# EAGLE schematic 9250 (EAGLE 9.2.2)
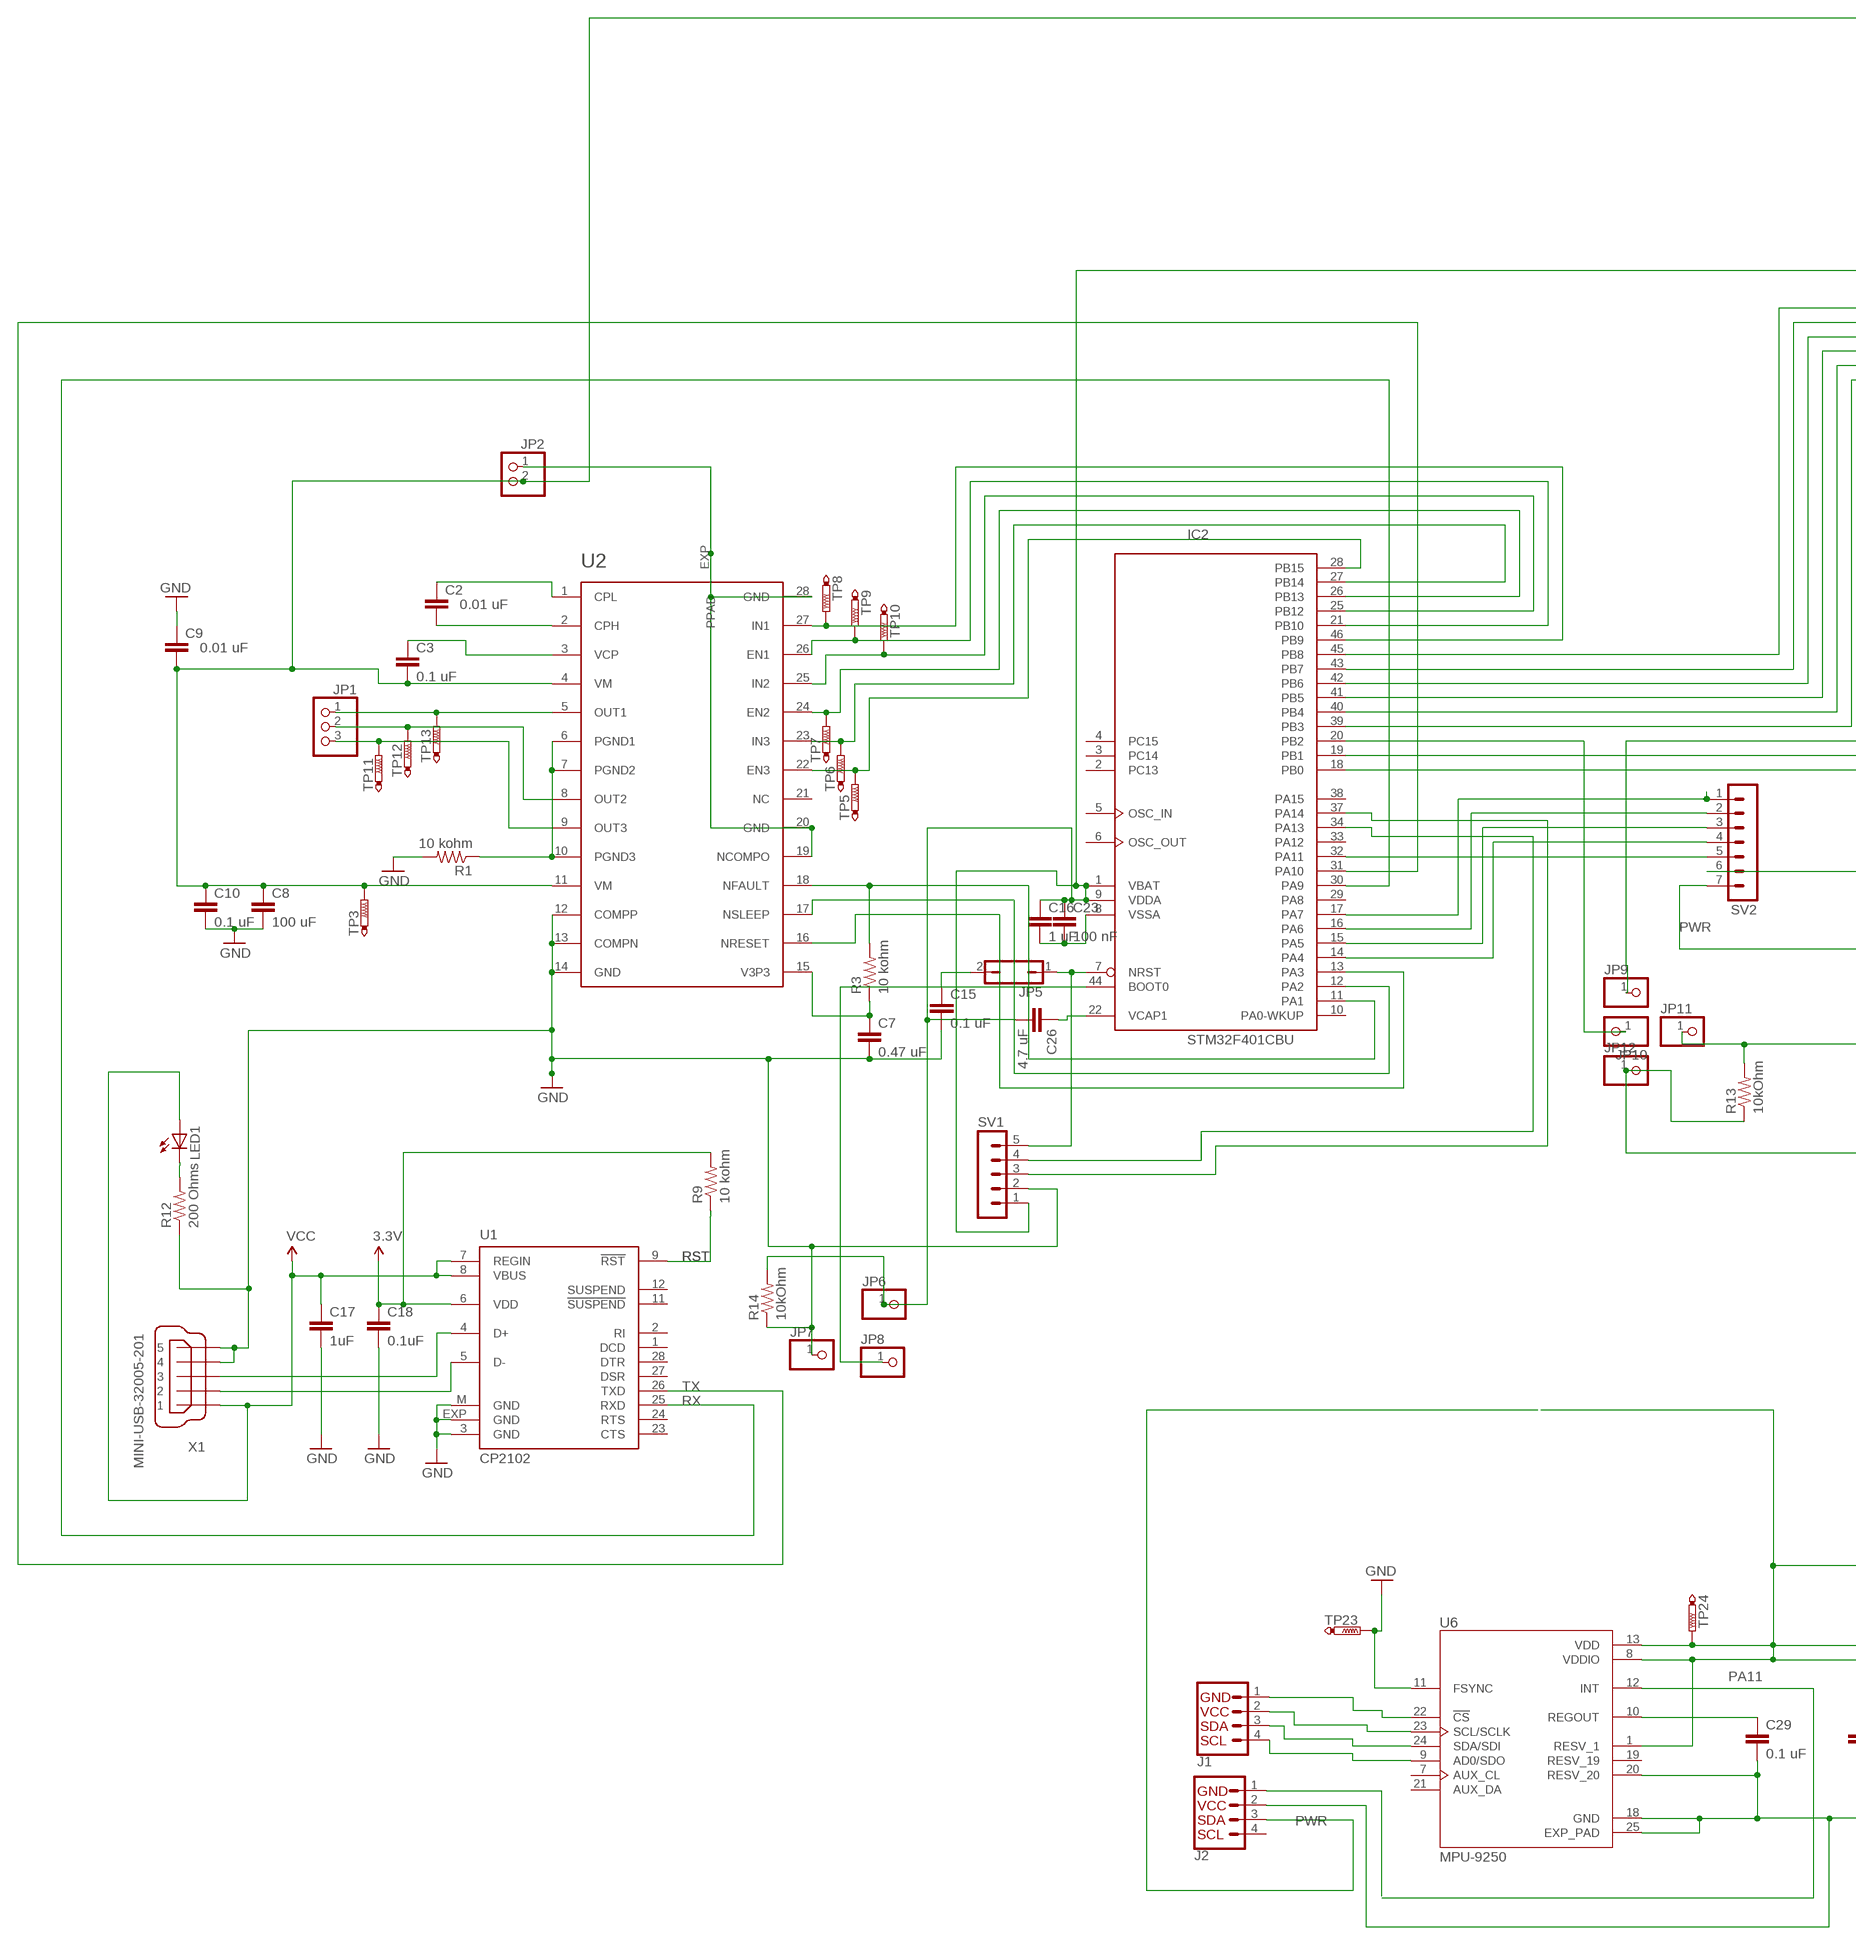
[diagram p0: schematic, sheet 1, part 1 of 2]
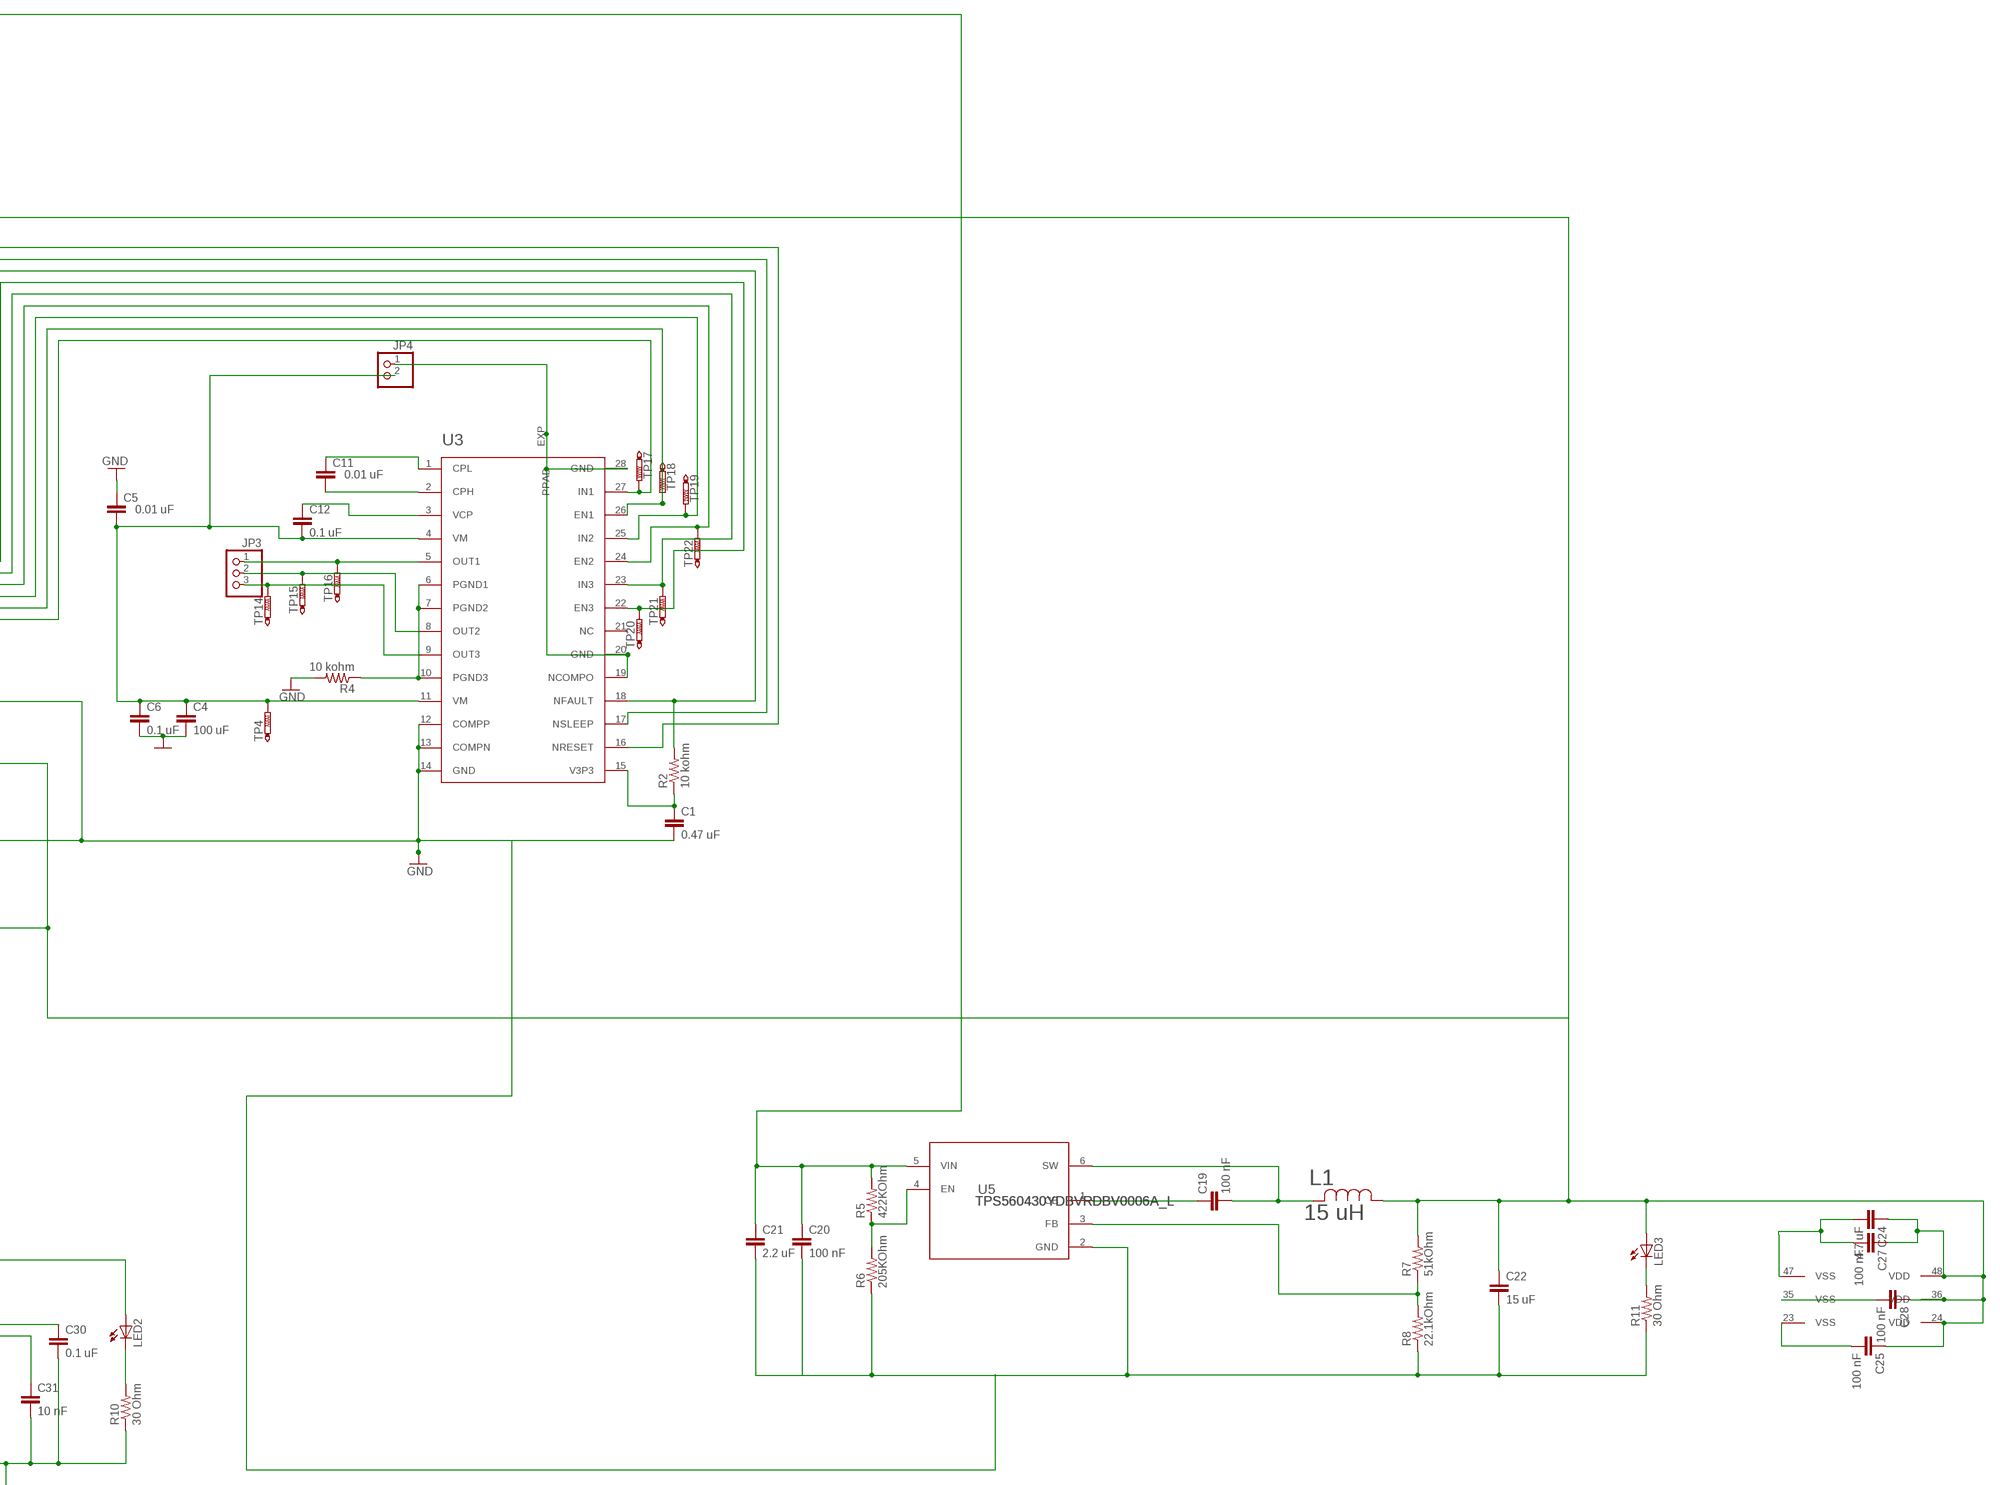
[diagram p1: schematic, sheet 1, part 2 of 2]

## Parts
C1  0.47 uF  C-EUC1210K  [C1210K]
C2  0.01 uF  C-EUC1210K  [C1210K]
C3  0.1 uF  C-EUC1210K  [C1210K]
C4  100 uF  C-EUC1210K  [C1210K]
C5  0.01 uF  C-EUC1210K  [C1210K]
C6  0.1 uF  C-EUC1210K  [C1210K]
C7  0.47 uF  C-EUC1210K  [C1210K]
C8  100 uF  C-EUC1210K  [C1210K]
C9  0.01 uF  C-EUC1210K  [C1210K]
C10  0.1 uF  C-EUC1210K  [C1210K]
C11  0.01 uF  C-EUC1210K  [C1210K]
C12  0.1 uF  C-EUC1210K  [C1210K]
C15  0.1 uF  C-EUC1210K  [C1210K]
C16  1 uF  C-EUC1210K  [C1210K]
C17  1uF  CAP0603  [0603]
C18  0.1uF  CAP0603  [0603]
C19  100 nF  C-EUC0402K  [C0402K]
C20  100 nF  C-EUC0402K  [C0402K]
C21  2.2 uF  C-EUC0402K  [C0402K]
C22  15 uF  C-EUC0402K  [C0402K]
C23  100 nF  C-EUC1210K  [C1210K]
C24  4.7 uF  C-EUC1210K  [C1210K]
C25  100 nF  C-EUC1210K  [C1210K]
C26  4.7 uF  C-EUC1210K  [C1210K]
C27  100 nF  C-EUC1210K  [C1210K]
C28  100 nF  C-EUC1210K  [C1210K]
C29  0.1 uF  C-EU025-025X050  [C025-025X050]
C30  0.1 uF  C-EU025-025X050  [C025-025X050]
C31  10 nF  C-EU025-025X050  [C025-025X050]
IC2  STM32F401CBU  [UFQFPN48]
J1  QWIIC_CONNECTORJS-1MM  [1X04_1MM_RA]
J2  QWIIC_CONNECTORJS-1MM  [1X04_1MM_RA]
JP1  PINHD-1X3/90  [1X03/90]
JP2  PINHD-1X2/90  [1X02/90]
JP3  PINHD-1X3/90  [1X03/90]
JP4  PINHD-1X2/90  [1X02/90]
JP5  JP1Q  [JP1]
JP6  PINHD-1X1  [1X01]
JP7  PINHD-1X1  [1X01]
JP8  PINHD-1X1  [1X01]
JP9  PINHD-1X1  [1X01]
JP10  PINHD-1X1  [1X01]
JP11  PINHD-1X1  [1X01]
JP12  PINHD-1X1  [1X01]
L1  15 uH  SRN3015-150M  [IND_BOURNS_SRN3015]
LED1  LED_ESML0603  [LED_SML0603]
LED2  LED_ESML0603  [LED_SML0603]
LED3  LED_ESML0603  [LED_SML0603]
R1  10 kohm  R-US_M2012  [M2012]
R2  10 kohm  R-US_M2012  [M2012]
R3  10 kohm  R-US_M2012  [M2012]
R4  10 kohm  R-US_M2012  [M2012]
R5  422KOhm  R-US_M0805  [M0805]
R6  205KOhm  R-US_M0805  [M0805]
R7  51kOhm  R-US_M0805  [M0805]
R8  22.1kOhm  R-US_M0805  [M0805]
R9  10 kohm  R-US_M2012  [M2012]
R10  30 Ohm  R-US_M0805  [M0805]
R11  30 Ohm  R-US_M0805  [M0805]
R12  200 Ohms  R-US_M0805  [M0805]
R13  10kOhm  R-US_M0805  [M0805]
R14  10kOhm  R-US_M0805  [M0805]
SV1  MA05-1  [MA05-1]
SV2  MA07-1  [MA07-1]
TP3  PTR1TP12R  [TP12R]
TP4  PTR1TP12R  [TP12R]
TP5  PTR1TP12R  [TP12R]
TP6  PTR1TP12R  [TP12R]
TP7  PTR1TP12R  [TP12R]
TP8  PTR1TP12R  [TP12R]
TP9  PTR1TP12R  [TP12R]
TP10  PTR1TP12R  [TP12R]
TP11  PTR1TP12R  [TP12R]
TP12  PTR1TP12R  [TP12R]
TP13  PTR1TP12R  [TP12R]
TP14  PTR1TP12R  [TP12R]
TP15  PTR1TP12R  [TP12R]
TP16  PTR1TP12R  [TP12R]
TP17  PTR1TP12R  [TP12R]
TP18  PTR1TP12R  [TP12R]
TP19  PTR1TP12R  [TP12R]
TP20  PTR1TP12R  [TP12R]
TP21  PTR1TP12R  [TP12R]
TP22  PTR1TP12R  [TP12R]
TP23  PTR1TP12R  [TP12R]
TP24  PTR1TP12R  [TP12R]
U1  CP2102  CP210X_USB_UART  [MLP28]
U2  DRV8313PWPR  [HTSSOP28PWP]
U3  DRV8313PWPR  [HTSSOP28PWP]
U5  TPS560430YDBVRDBV0006A_L  [DBV0006A_L]
U6  MPU-9250  [QFN40P300X300X105-25N]
X1  MINI-USB-32005-201  [32005-201]

## Nets
3.3V: C18.1 R9.2 U1.6(VDD)
BATTERY: C3.2 C8.1 C9.2 C10.1 C20.1 C21.1 JP2.2 R5.2 TP3.TP U2.4(VM) U2.11(VM) U5.5(VIN)
BATTERY1: C4.1 C5.2 C6.1 C12.2 JP4.2 TP4.TP U3.4(VM) U3.11(VM)
CPH: C2.2 U2.2(CPH)
CPH1: C11.2 U3.2(CPH)
CPL: C2.1 U2.1(CPL)
CPL1: C11.1 U3.1(CPL)
EN4: IC2.19(PB1) TP18.TP U3.26(EN1)
EN5: IC2.39(PB3) TP22.TP U3.24(EN2)
EN6: IC2.41(PB5) TP20.TP U3.22(EN3)
GND: C1.2 C4.2 C5.1 C6.2 C7.2 C8.2 C9.1 C10.2 C15.2 C17.2 C18.2 JP2.1 JP4.1 JP7.1 JP11.1 R1.2 R4.2 R12.1 R13.2 R14.1 SV1.2 SV2.6 TP23.TP U1.3(GND) U1.EXP(GND) U1.M(GND) U2.12(COMPP) U2.13(COMPN) U2.14(GND) U2.19(NCOMPO) U2.20(GND) U2.28(GND) U2.EXP(PPAD) U3.12(COMPP) U3.13(COMPN) U3.14(GND) U3.19(NCOMPO) U3.20(GND) U3.28(GND) U3.EXP(PPAD) U6.11(FSYNC) X1.4 X1.5
IN4: IC2.18(PB0) TP17.TP U3.27(IN1)
IN5: JP9.1 TP19.TP U3.25(IN2)
IN6: IC2.40(PB4) TP21.TP U3.23(IN3)
N$1: IC2.32(PA11) SV2.5
N$2: IC2.46(PB9) TP8.TP U2.27(IN1)
N$3: IC2.21(PB10) TP9.TP U2.26(EN1)
N$4: C15.1 JP5.2
N$5: C29.1 U6.10(REGOUT)
N$6: IC2.30(PA9) U1.25(RXD)
N$7: IC2.31(PA10) U1.26(TXD)
N$8: IC2.17(PA7) SV2.1
N$9: C26.1 IC2.22(VCAP1)
N$10: IC2.14(PA4) SV2.4
N$11: IC2.25(PB12) TP10.TP U2.25(IN2)
N$12: C30.1 C31.1 LED2.A TP24.TP U6.1(RESV_1) U6.8(VDDIO) U6.13(VDD)
N$13: IC2.26(PB13) TP7.TP U2.24(EN2)
N$14: IC2.27(PB14) TP6.TP U2.23(IN3)
N$15: IC2.28(PB15) TP5.TP U2.22(EN3)
N$16: IC2.7(NRST) JP5.1 SV1.5
N$17: C20.2 C21.2 C22.2 R6.1 R8.1 R11.1 U5.2(GND)
N$18: U1.5(D-) X1.2
N$19: U1.4(D+) X1.3
N$20: IC2.44(BOOT0) JP8.1
N$21: C24.2 C27.2 IC2.47(VSS)
N$22: LED2.C R10.2
N$23: R5.1 R6.2 U5.4(EN)
N$24: C19.1 U5.1(CB)
N$25: C19.2 L1.2 U5.6(SW)
N$26: C25.2 IC2.23(VSS)
N$27: R7.1 R8.2 U5.3(FB)
N$28: C28.2 IC2.35(VSS)
N$29: C16.2 C23.2 IC2.8(VSSA)
N$30: J2.1
N$31: C29.2 C30.2 C31.2 J2.2 R10.1 U6.18(GND) U6.20(RESV_20) U6.25(EXP_PAD)
N$32: LED3.C R11.2
N$33: LED1.C R12.2
N$34: IC2.15(PA5) SV2.3
N$35: IC2.16(PA6) SV2.2
N$36: IC2.20(PB2) JP10.1
NFAULT: IC2.11(PA1) R3.2 U2.18(NFAULT)
NFAULT1: IC2.42(PB6) R2.2 U3.18(NFAULT)
NRESET: IC2.13(PA3) U2.16(NRESET)
NRESET1: IC2.45(PB8) U3.16(NRESET)
NSLEEP: IC2.12(PA2) U2.17(NSLEEP)
NSLEEP1: IC2.43(PB7) U3.17(NSLEEP)
OUT1: JP1.1 TP13.TP U2.5(OUT1)
OUT2: JP1.2 TP12.TP U2.8(OUT2)
OUT3: JP1.3 TP11.TP U2.9(OUT3)
OUT4: JP3.1 TP16.TP U3.5(OUT1)
OUT5: JP3.2 TP15.TP U3.8(OUT2)
OUT6: JP3.3 TP14.TP U3.9(OUT3)
PA11: U6.12(INT)
PA12: J1.4 U6.9(AD0/SDO)
PA13: J1.3 U6.24(SDA/SDI)
PA14: J1.2 U6.23(SCL/SCLK)
PA15: J1.1 U6.22(!CS)
PGND: R1.1 U2.6(PGND1) U2.7(PGND2) U2.10(PGND3)
PGND1: R4.1 U3.6(PGND1) U3.7(PGND2) U3.10(PGND3)
PWR: C16.1 C22.1 C23.1 C24.1 C25.1 C26.2 C27.1 C28.1 IC2.1(VBAT) IC2.9(VDDA) IC2.24(VDD) IC2.36(VDD) IC2.48(VDD) J2.3 JP6.1 JP12.1 L1.1 LED3.A R7.2 R13.1 R14.2 SV1.1 SV2.7
RST: R9.1 U1.9(!RST)
RX: IC2.34(PA13) SV1.4
TX: IC2.37(PA14) SV1.3
V3P1: C1.1 R2.1 U3.15(V3P3)
V3P3: C7.1 R3.1 U2.15(V3P3)
VCC: C17.1 LED1.A U1.7(REGIN) U1.8(VBUS) X1.1
VCP: C3.1 U2.3(VCP)
VCP1: C12.1 U3.3(VCP)
Unconnected: IC2.2(PC13) IC2.3(PC14) IC2.4(PC15) IC2.5(OSC_IN) IC2.6(OSC_OUT) IC2.10(PA0-WKUP) IC2.29(PA8) IC2.33(PA12) IC2.38(PA15) J2.4 U1.1(DCD) U1.2(RI) U1.11(!SUSPEND) U1.12(SUSPEND) U1.23(CTS) U1.24(RTS) U1.27(DSR) U1.28(DTR) U2.21(NC) U3.21(NC) U6.7(AUX_CL) U6.19(RESV_19) U6.21(AUX_DA)

## Library data of the parts
C1-C12 C15 C16 C19-C31 = rcl:C-EU: CAPACITOR, European symbol; SPICEPREFIX: C
C17 C18 = SparkFun:CAP: Capacitor Standard 0603 ceramic capacitor, and 0.1" leaded capacitor.
IC2 = micro-stm_v3:STM32F401C*U: ARM 32-bit Cortex™-M3 CPU 84 MHz maximum frequency 128 to 256 Kbytes of Flash memory 64 kbytes of SRAM 36 GPIOs 1.7 to 3.6 V application supply
J1 J2 = SparkFun-Connectors:QWIIC_CONNECTOR: SparkFun I2C Standard Qwiic Connector An SMD 1mm pitch JST connector makes it easy and quick (get it? Qwiic?) to connect I2C devices to each other. The Qwiic system <http://www.sparkfun.com/qwiic> enables fast and solderless connection between popular platforms and various sensors and actuators. We carry 200mm <https://www.sparkfun.com/products/14204>, 100mm <https://www.sparkfun.com/products/14205>, 50mm <https://www.sparkfun.com/products/14206>, and breadboard friendly <https://www.sparkfun.com/products/14207> Qwiic cables. We also offer 10 pcs strips <https://www.sparkfun.com/products/14323> the SMD connectors.; PROD_ID: CONN-13694
JP1 JP3 = pinhead:PINHD-1X3: PIN HEADER
JP2 JP4 = pinhead:PINHD-1X2: PIN HEADER
JP5 = jumper:JP1Q: JUMPER
JP6-JP12 = pinhead:PINHD-1X1: PIN HEADER
L1 = Inductor:SRN3015-150M; MANUFACTURER_PART_NUMBER: SRN3015150M; VENDOR: Bourns Electronics
LED1-LED3 = eagle-ltspice:LED_E: LED Source: http://www.osram.convergy.de Source: www.luxeon.com Source: www.kingbright.com; SPICEMODEL: NONE; SPICEPREFIX: D; SPICETYPE: diode
R1-R14 = rcl:R-US_: RESISTOR, American symbol; SPICEPREFIX: R
SV1 = con-lstb:MA05-1: PIN HEADER; OC_FARNELL: unknown; OC_NEWARK: unknown
SV2 = con-lstb:MA07-1: PIN HEADER; OC_FARNELL: unknown; OC_NEWARK: unknown
TP3-TP24 = testpad:PTR1: TEST PIN
U1 = SparkFun:CP210X_USB_UART: Single-Chip USB to UART Bridge Source: www.silabs.com .. CP2101.pdf / cp2102.pdf. Spark Fun Electronics SKU : COM-00310
U2 U3 = gimbal:DRV8313PWPR
U5 = Voltage Regulator:TPS560430YDBVR
U6 = MPU-9250:MPU-9250: Axis=3 Axis Gyro+3 Axis Accel+Compass. Pin For Pin With m; AVAILABILITY: Unavailable; DESCRIPTION: SMD Gyroscope/Accelerometer/Magnetometer Sensor; 9-AXIS; MF: TDK InvenSense; MP: MPU-9250; PACKAGE: QFN-24 InvenSense; PRICE: None
X1 = con-cypressindustries:MINI-USB-: MINI USB-B Conector Source: www.cypressindustries.com; OC_FARNELL: unknown; OC_NEWARK: unknown